# Altium schematic sheet pmu.SchDoc
size A; SheetNumber: 1; SheetTotal: 1; SPICEModelCacheIUZUPHTK: <root> / <DocumentId>IUZUPHTK</DocumentId> / </root>
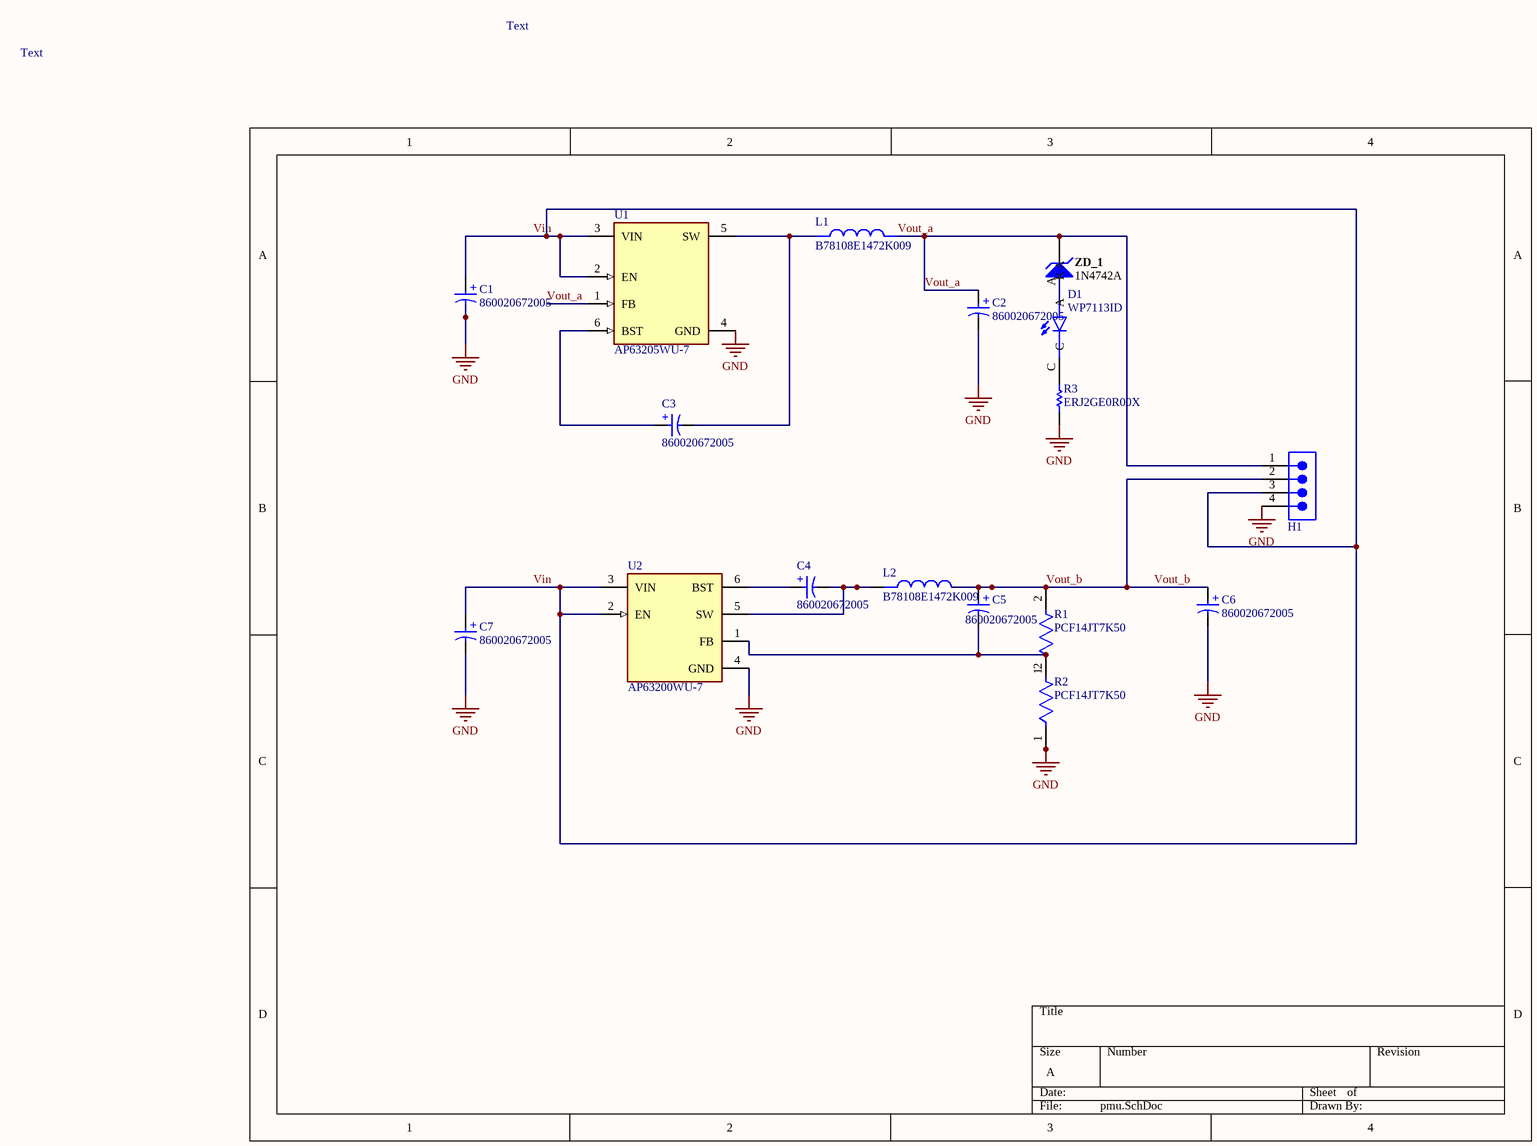
[diagram p0: pmu.SchDoc]

## Parts
C1  860020672005  [WCAP-ATG5_D5H11]
C2  860020672005  [WCAP-ATG5_D5H11]
C3  860020672005  [WCAP-ATG5_D5H11]
C4  860020672005  [WCAP-ATG5_D5H11]
C5  860020672005  [WCAP-ATG5_D5H11]
C6  860020672005  [WCAP-ATG5_D5H11]
C7  860020672005  [WCAP-ATG5_D5H11]
D1  WP7113ID  [LED_WP7113ID]
H1  61300411121  [61300411121]  (value not drawn)
L1  B78108E1472K009  [INDAD1430W80L950D400]
L2  B78108E1472K009  [INDAD1430W80L950D400]
R1  PCF14JT7K50  [FP-CF14-MFG]
R2  PCF14JT7K50  [FP-CF14-MFG]
R3  ERJ2GE0R00X  [RESC1005X40X25LL05T05]
U1  AP63205WU-7  [FP-TSOT26-MFG]
U2  AP63200WU-7  [FP-TSOT26-MFG]
ZD_1  1N4742A  [FAIR-DO-41-2_V]

## Nets
GND: C1.2(N) C2.2(N) C6.2(N) C7.2(N) H1.4 R2.1 R3.1 U1.4(GND) U2.4(GND)
Vin: C1.1(P) C7.1(P) H1.3 U1.2(EN) U1.3(VIN) U2.2(EN) U2.3(VIN)
Vout_a: C2.1(P) H1.1 L1.2 U1.1(FB) ZD_1.2(K)
Vout_b: C5.1(P) C6.1(P) H1.2 L2.2 R1.2
NetC3_1: C3.1(P) U1.6(BST)
NetC3_2: C3.2(N) L1.1 U1.5(SW)
NetC4_1: C4.1(P) U2.6(BST)
NetC4_2: C4.2(N) L2.1 U2.5(SW)
NetC5_2: C5.2(N) R1.1 R2.2 U2.1(FB)
NetD1_A: D1.A ZD_1.1(A)
NetD1_C: D1.C R3.2

## Notes on the sheet
- Text
- (in symbol CMP-03913-53914228-1) +

## Library data of the parts
C1-C7 = CMP-03913-53914228-1: 860020672005 WCAP-ATG5 Aluminum Electrolytic Capacitors; Voltage Rating: 50V; Ripple Current: 13mA; Pitch: 2mm; Tolerance: 20%; Leakage Current: 3µA; Polarity: Polar; Capacitance: 1µF; ESR (Equivalent Series Resistance): 39.553Ω; Hole Diameter: 800µm; Life (Hours): 2000hours; Lead Pitch: 2.0066mm; Max Operating Temperature: 105°C; Packaging: Tape & Box (TB); Height - Seated (Max): 12.4968mm; Min Operating Temperature: -40°C; Height: 11mm; Length: 11mm; Diameter: 5mm; Case/Package: Radial; Voltage Rating (DC): 50V; RoHS: Compliant; REACH SVHC: Unknown; Mount: Through Hole; NexarPartId: 53914228
D1 = WP7113ID: Red 617nm LED Indication - Discrete 2V Radial; MF: Kingbright; Price: None; MP: WP7113ID; Package: Radial Kingbright; Check_prices: https://www.snapeda.com/parts/WP7113ID/Kingbright/view-part/?ref=eda; Purchase-URL: https://pricing.snapeda.com/search/part/WP7113ID/?ref=eda; Availability: In Stock; Value: *; SnapEDA_Link: https://www.snapeda.com/parts/WP7113ID/Kingbright/view-part/?ref=snap
H1 = 61300411121: WR-PHD Pin Header, THT, Vertical, pitch 2.54mm, 1 Row, 4P; Manufacturer: Wurth Elektronik; Contact Resistance: 20mOhm; Rated Current: 3A; Working Voltage: 250V; Withstanding Voltage: 500V; Manufacturer Part Number: 61300411121; Category: Board-to-Board Connectors; Match Code: WR-PHD; ComponentLink1Description: Website Link; ComponentLink1URL: https://www.we-online.com/redexpert/article/61300411121?ad; ComponentLink2Description: Datasheet Link; ComponentLink2URL: https://www.we-online.com/redexpert/spec/61300411121?ad; Mount: Through Hole; Operating Temperature Max: 105°C; Operating Temperature Min: -40°C; Packaging: Bag; Gender: Pin Header; Number of Pins: 4; Number of Rows: 1; Orientation: Vertical; Pitch: 2.54mm
L1 L2 = B78108E1472K009: 4.7 ÂµH Unshielded Drum Core, Wirewound Inductor 2.75 A 85mOhm Max Axial; MF: EPCOS; Check_prices: https://www.snapeda.com/parts/B78108E1472K009/EPCOS/view-part/?ref=eda; Value: *; MP: B78108E1472K009; Package: None; Purchase-URL: https://pricing.snapeda.com/search/part/B78108E1472K009/?ref=eda; SnapEDA_Link: https://www.snapeda.com/parts/B78108E1472K009/EPCOS/view-part/?ref=snap; Digi-Key_Part_Number: 495-76025-1-ND
R1 R2 = CMP-26528-000003-1: RES 7.5K OHM 1/4W 5% AXIAL; Max Power Dissipation: 250mW; Temperature Coefficient: -400ppm/°C; Resistance: 7.5kR; RoHS Compliant: Yes; Lead Free: Lead Free; Max Operating Temperature: 155°C; Case/Package: Axial; Tolerance: 5%; Power Rating: 250mW; Diameter: 2.3mm; Features: Flame Retardant Coating; Series: CF; Resistor Type: Carbon Film; Number of Terminations: 2; Length: 0.256inch; Min Operating Temperature: -55°C; Contact Plating: Tin; Packaging: Tape and Reel; Mount: Through Hole; Radiation Hardening: No
R3 = CMP-2000-07451-1: Chip Resistor, 0 Ohm, 0.1 W, -55 to 155 degC, 0402 (1005 Metric), RoHS, Tape and Reel; Manufacturer: Panasonic; Voltage Rating (DC): 50V; Temperature Coefficient: 600ppm/��C; Max Power Dissipation: 100mW; Resistance: 0mOhm; Tolerance: 5%; Number of Terminations: 2; Mount: SurfaceMount; Height: 0.35mm; Packaging: TapeandReel; Contact Plating: Tin; Manufacturer URL: http://www.panasonic.com/; Composition: ThickFilm; Max Operating Temperature: 155degC; REACH SVHC: NoSVHC; Case/Package: 0402; Package Reference: 402; Depth: 0.5mm; Package Description: 2-Pin Surface Mount Device, Body 1 x 0.5 mm; Datasheet URL: https://industrial.panasonic.com/cdbs/www-data/pdf/RDA0000/AOA0000C301.pdf; RoHSCompliant: True; Case Code (Imperial): 0402; Military Standard: Not; Min Operating Temperature: -55degC; Power Rating: 100mW; Datasheet Version: 03/2015; Length: 1mm; Case Code (Metric): 1005; Termination: SMD/SMT; Mounting Technology: SurfaceMount; Voltage Rating: 50V; Width: 0.02inch; Package Quantity: 1; Lead Free: LeadFree; Radiation Hardening: No
U1 = CMP-12757-000001-1: IC REG BUCK 5V 2A TSOT26; Manufacturer: Diodes Inc.; Max Junction Temp: +160°C; Max Duty Cycle: 100%; Standoff Height: 0.01mm; Max Supply Voltage: 32V; Number Of Outputs: 1; Min Supply Voltage: 3.8V; Output Type: Fixed; Switching Frequency: 1100kHz; Nominal Supply Current: 22uA; Automotive: No; RoHS: TRUE; Switching Topology: Buck; Temperature: -40°C to +85°C; Footprint Url: https://www.diodes.com/assets/Package-Files/TSOT26.pdf; Lead Free: Yes; Digikey Description: IC REG BUCK 5V 2A TSOT26; Device Class L3: Voltage Regulators - Switching; Ambient Temperature Range High: +85°C; Category: IC; Package: TSOT26; Output Voltage: 5V; Output Current: 2A; ComponentLink2Description: Datasheet; Device Class L2: Power Management ICs; Ambient Temperature Range Low: -40°C; Temperature Range High: +85°C; Temperature Range Low: -40°C; Octopart: https://octopart.com/ap63205wu-7-diodes+inc.-98099551; Manufacturer Part Number: AP63205WU-7; Height: 1mm; Device Class L1: Integrated Circuits (ICs); ComponentLink2URL: https://www.diodes.com/assets/Datasheets/AP63200-AP63201-AP63203-AP63205.pdf
U2 = CMP-12757-000010-1: IC REG BUCK ADJUSTABLE 2A TSOT26; Manufacturer: Diodes Inc.; Switching Frequency: 500kHz; Max Supply Voltage: 32V; Number Of Outputs: 1; Nominal Supply Current: 22uA; Min Supply Voltage: 3.8V; Output Type: AdjustableProgrammable; Max Junction Temp: +160°C; Standoff Height: 0.01mm; Octopart: https://octopart.com/ap63200wu-7-diodes+inc.-98099548; Height: 1mm; Temperature Range Low: -40°C; Output Current: 2A; ComponentLink2URL: https://www.diodes.com/assets/Datasheets/AP63200-AP63201-AP63203-AP63205.pdf; Switching Topology: Buck; Automotive: No; Device Class L1: Integrated Circuits (ICs); Ipc Land Pattern Name: SOT95P280X100-6; Package: TSOT26; Temperature Range High: +85°C; RoHS: TRUE; Ambient Temperature Range High: +85°C; Device Class L3: Voltage Regulators - Switching; Temperature: -40°C to +85°C; Device Class L2: Power Management ICs; Footprint Url: https://www.diodes.com/assets/Package-Files/TSOT26.pdf; Mouser Description: AP63200 Series 1.2 V 2 A Adjustable Synchronous Buck Converter - TSOT-26; Category: IC; ComponentLink2Description: Datasheet; Digikey Description: IC REG BUCK ADJUSTABLE 2A TSOT26; Lead Free: Yes; Ambient Temperature Range Low: -40°C; Manufacturer Part Number: AP63200WU-7
ZD_1 = CMP-0892-00001-1: Zener Diode, 12V, 1W, 5%, -65 to 200 degC, 2-Pin DO-41, Body 2.72 x 5.2 mm, RoHS; Manufacturer: Fairchild Semiconductor; PD (W): 1; VZ (Min.) (V): 11.4; VZ (Max.) (V): 12.6; ZZ (Max) (ohm): 8; IR (uA): 5; Test Current IZ (mA): 21; PartNumber: 1N4742A; PackageVersion: Rev. 2; DatasheetVersion: Rev. H3; Mounting Technology: Through Hole; Tolerance: 5%; PackageDescription: 2-Pin Axial leaded, Body 2.72 x 5.2 mm, Lead Spread 25.4 mm; ComponentLink1Description: Manufacturer URL; ComponentLink3Description: Package Specification; ComponentLink2Description: Datasheet; ComponentLink2URL: http://www.fairchildsemi.com/ds/1N/1N4744A.pdf; PackageReference: DO-41-2; RoHS: TRUE; Operating and Storage Temperature Range: -65 to 200 degC; ComponentLink3URL: http://www.fairchildsemi.com/dwg/DO/DO41A.pdf; ComponentLink1URL: http://www.fairchildsemi.com/